# Altium schematic sheet Sheet1.SchDoc
size A4
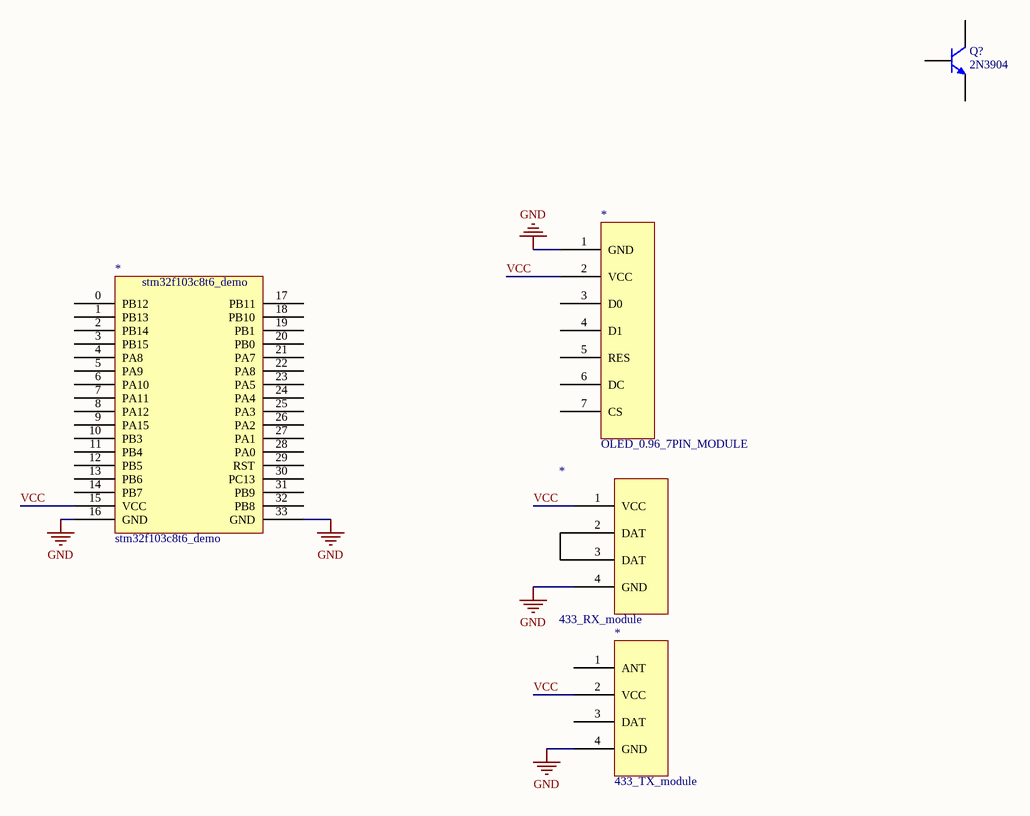
[diagram p0: Sheet1.SchDoc]

## Parts
(Parts that share a designator on the sheet are numbered #1, #2 ... from top to bottom, then left to right.)
*#1  OLED_0.96_7PIN_MODULE
*#2  433_RX_module
*#3  stm32f103c8t6_demo
*#4  433_TX_module
Q?  2N3904  [TO-92A]

## Nets
GND: *#1.1(GND) *#2.4(GND) *#3.16(GND) *#3.33(GND) *#4.4(GND)
VCC: *#1.2(VCC) *#2.1(VCC) *#3.15(VCC) *#4.2(VCC)

Not connected (* = marked no-connect by the designer): *#1 3(D0) 4(D1) 5(RES) 6(DC) 7(CS); *#2 2(DAT) 3(DAT); *#3 0(PB12) 1(PB13) 2(PB14) 3(PB15) 4(PA8) 5(PA9) 6(PA10) 7(PA11) 8(PA12) 9(PA15) 10(PB3) 11(PB4) 12(PB5) 13(PB6) 14(PB7) 17(PB11) 18(PB10) 19(PB1) 20(PB0) 21(PA7) 22(PA8) 23(PA5) 24(PA4) 25(PA3) 26(PA2) 27(PA1) 28(PA0) 29(RST) 30(PC13) 31(PB9) 32(PB8); *#4 1(ANT) 3(DAT); Q? 1(E) 2(B) 3(C)

## Library data of the parts
Q? = 2N3904: NPN General Purpose Amplifier; Published: 8-Jun-2000; LatestRevisionDate: 15-Jan-2003; LatestRevisionNote: PCB Footprint 'BCY-W3/D4.7' replaced; DatasheetVersion: 1997; PackageVersion: Sep-1998; PackageReference: TO-92A; Publisher: Altium Limited; PackageDescription: TO, Flat Index; 3 In-Line, Axial Leads; Body Dia. 4.5mm; Leads 0.51 x 0.48 mm (max); ComponentLink1Description: Manufacturer Link; ComponentLink1URL: http://www.fairchildsemi.com/; ComponentLink2Description: Datasheet; ComponentLink2URL: http://www.fairchildsemi.com/ds/2N%2F2N3904.pdf